# Altium schematic sheet V10_030F4_20200425.SchDoc
size A4
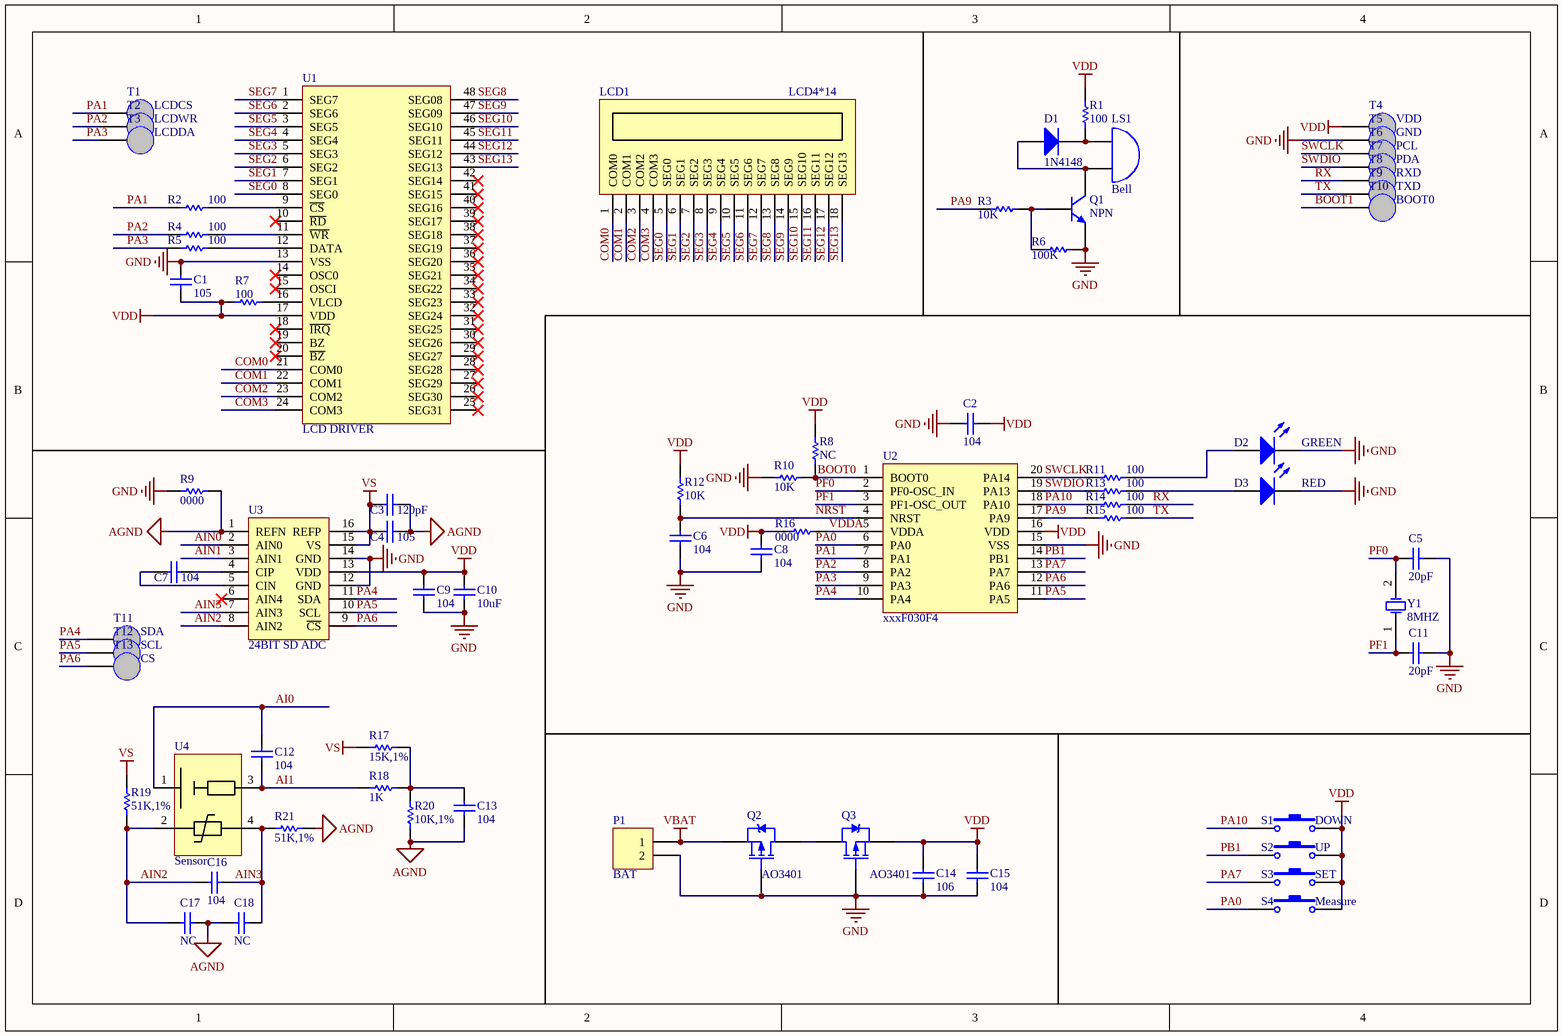
[diagram p0: V10_030F4_20200425.SchDoc]

## Parts
C1  105  [RAD-0.3]
C2  104  [RAD-0.3]
C3  120pF  [RAD-0.3]
C4  105  [RAD-0.3]
C5  20pF  [RAD-0.3]
C6  104  [RAD-0.3]
C7  104  [RAD-0.3]
C8  104  [RAD-0.3]
C9  104  [RAD-0.3]
C10  10uF  [RAD-0.3]
C11  20pF  [RAD-0.3]
C12  104  [RAD-0.3]
C13  104  [RAD-0.3]
C14  106  [RAD-0.3]
C15  104  [RAD-0.3]
C16  104  [RAD-0.3]
C17  NC  [RAD-0.3]
C18  NC  [RAD-0.3]
D1  1N4148  [SMC]
D2  GREEN  [LED-0]
D3  RED  [LED-0]
LCD1  LCD4*14
LS1  Bell  [PIN2]
P1  BAT  [HDR1X2]
Q1  NPN  [TO-226-AA]
Q2  AO3401  [TO-220AB]
Q3  AO3401  [TO-220AB]
R1  100  [AXIAL-0.3]
R2  100  [AXIAL-0.3]
R3  10K  [AXIAL-0.3]
R4  100  [AXIAL-0.3]
R5  100  [AXIAL-0.3]
R6  100K  [AXIAL-0.3]
R7  100  [AXIAL-0.3]
R8  NC  [AXIAL-0.3]
R9  0000  [AXIAL-0.3]
R10  10K  [AXIAL-0.3]
R11  100  [AXIAL-0.3]
R12  10K  [AXIAL-0.3]
R13  100  [AXIAL-0.3]
R14  100  [AXIAL-0.3]
R15  100  [AXIAL-0.3]
R16  0000  [AXIAL-0.3]
R17  15K,1%  [AXIAL-0.3]
R18  1K  [AXIAL-0.3]
R19  51K,1%  [AXIAL-0.3]
R20  10K,1%  [AXIAL-0.3]
R21  51K,1%  [AXIAL-0.3]
S1  DOWN  [SPST-2]
S2  UP  [SPST-2]
S3  SET  [SPST-2]
S4  Measure  [SPST-2]
T1  LCDCS
T2  LCDWR
T3  LCDDA
T4  VDD
T5  GND
T6  PCL
T7  PDA
T8  RXD
T9  TXD
T10  BOOT0
T11  SDA
T12  SCL
T13  CS
U1  LCD DRIVER
U2  xxxF030F4
U3  24BIT SD ADC
U4  Sensor
Y1  8MHZ  [R38]

## Nets
AGND: C3.1 C4.1 C13.1 C17.1 C18.2 R9.1 R20.1 R21.2 U3.1(REFN)
GND: C1.2 C2.2 C5.1 C6.1 C8.1 C9.2 C10.2 C11.1 C14.1 C15.1 D2.2(K) D3.2(K) P1.2 Q1.3(E) Q2.1(G) Q3.1(G) R6.2 R9.2 R10.2 T5.1(TEST) U1.13(VSS) U2.15(VSS) U3.12(GND) U3.14(GND)
VBAT: P1.1 Q2.3(S)
VDD: C1.1 C2.1 C8.2 C9.1 C10.1 C14.2 C15.2 Q3.3(S) R1.2 R7.1 R8.1 R12.1 R16.2 S1.2 S2.2 S3.2 S4.2 T4.1(TEST) U1.17(VDD) U2.16(VDD) U3.13(VDD)
VS: C3.2 C4.2 R17.2 R19.2 U3.15(VS) U3.16(REFP)
AI0: C12.2 U4.1
AI1: C12.1 R18.2 U4.3(-1)
AIN0: U3.2(AIN0)
AIN1: U3.3(AIN1)
AIN2: C16.1 C17.2 R19.1 U3.8(AIN2) U4.2
AIN3: C16.2 C18.1 R21.1 U3.7(AIN3) U4.4(-0)
BOOT0: R8.2 R10.1 U2.1(BOOT0)
BOOT1: T10.1(TEST)
COM0: LCD1.1(COM0) U1.21(COM0)
COM1: LCD1.2(COM1) U1.22(COM1)
COM2: LCD1.3(COM2) U1.23(COM2)
COM3: LCD1.4(COM3) U1.24(COM3)
NRST: C6.2 R12.2 U2.4(NRST)
PA0: S4.1 U2.6(PA0)
PA1: R2.1 T1.1(TEST) U2.7(PA1)
PA2: R4.1 T2.1(TEST) U2.8(PA2)
PA3: R5.1 T3.1(TEST) U2.9(PA3)
PA4: T11.1(TEST) U2.10(PA4) U3.11(SDA)
PA5: T12.1(TEST) U2.11(PA5) U3.10(SCL)
PA6: T13.1(TEST) U2.12(PA6) U3.9(~{CS})
PA7: S3.1 U2.13(PA7)
PA9: R3.1 R15.1 U2.17(PA9)
PA10: R14.1 S1.1 U2.18(PA10)
PB1: S2.1 U2.14(PB1)
PF0: C5.2 U2.2(PF0-OSC_IN) Y1.2(OSC2)
PF1: C11.2 U2.3(PF1-OSC_OUT) Y1.1(OSC1)
RX: R14.2 T8.1(TEST)
SEG0: LCD1.5(SEG0) U1.8(SEG0)
SEG1: LCD1.6(SEG1) U1.7(SEG1)
SEG2: LCD1.7(SEG2) U1.6(SEG2)
SEG3: LCD1.8(SEG3) U1.5(SEG3)
SEG4: LCD1.9(SEG4) U1.4(SEG4)
SEG5: LCD1.10(SEG5) U1.3(SEG5)
SEG6: LCD1.11(SEG6) U1.2(SEG6)
SEG7: LCD1.12(SEG7) U1.1(SEG7)
SEG8: LCD1.13(SEG8) U1.48(SEG08)
SEG9: LCD1.14(SEG9) U1.47(SEG09)
SEG10: LCD1.15(SEG10) U1.46(SEG10)
SEG11: LCD1.16(SEG11) U1.45(SEG11)
SEG12: LCD1.17(SEG12) U1.44(SEG12)
SEG13: LCD1.18(SEG13) U1.43(SEG13)
SWCLK: R11.1 T6.1(TEST) U2.20(PA14)
SWDIO: R13.1 T7.1(TEST) U2.19(PA13)
TX: R15.2 T9.1(TEST)
VDDA: R16.1 U2.5(VDDA)
NetC7_1: C7.1 U3.4(CIP)
NetC7_2: C7.2 U3.5(CIN)
NetC13_2: C13.2 R17.1 R18.1 R20.2
NetD1_1: D1.1(A) LS1.2(B) Q1.1(C)
NetD1_2: D1.2(K) LS1.1(A) R1.1
NetD2_1: D2.1(A) R11.2
NetD3_1: D3.1(A) R13.2
NetQ1_2: Q1.2(B) R3.2 R6.1
NetQ2_2: Q2.2(D) Q3.2(D)
NetR2_2: R2.2 U1.9(~{CS})
NetR4_2: R4.2 U1.11(~{WR})
NetR5_2: R5.2 U1.12(DATA)
NetR7_2: R7.2 U1.16(VLCD)

Not connected (* = marked no-connect by the designer): U1 10(~{RD})* 14(OSC0)* 15(OSCI)* 18(~{IRQ})* 19(BZ)* 20(~{BZ})* 25(SEG31)* 26(SEG30)* 27(SEG29)* 28(SEG28)* 29(SEG27)* 30(SEG26)* 31(SEG25)* 32(SEG24)* 33(SEG23)* 34(SEG22)* 35(SEG21)* 36(SEG20)* 37(SEG19)* 38(SEG18)* 39(SEG17)* 40(SEG16)* 41(SEG15)* 42(SEG14)*; U3 6(AIN4)*

## Library data of the parts
C1-C18 = Cap: Capacitor; Value: 100pF; Published: 8-Jun-2000; LatestRevisionDate: 17-Jul-2002; LatestRevisionNote: Re-released for DXP Platform.; PackageReference: RAD-0.3; Publisher: Altium Limited; PackageDescription: Radial Cap, Thru-Hole; 2 Leads; 0.3 in Pin Spacing
D1 = Diode: Default Diode; Published: 8-Jun-2000; LatestRevisionDate: 17-Jul-2002; LatestRevisionNote: Re-released for DXP Platform.; PackageVersion: Sep-1996; PackageReference: SMC; Publisher: Altium Limited; PackageDescription: DO-214-AB/SMC; 2 C-Bend Leads; Body 7.9 x 5.9 mm, inc. leads (LxW); Code_JEDEC: DO-214-AB
D2 D3 = LED0: Typical INFRARED GaAs LED; Published: 8-Jun-2000; LatestRevisionDate: 08-Jul-2005; LatestRevisionNote: Mech Layer 1 removed.; PackageReference: LED-0; Publisher: Altium Limited; PackageDescription: LED; 2 Leads
LCD1 = LCD-4*14: LCD Displayer
LS1 = Bell: Electrical Bell; Published: 24-Mar-1999; LatestRevisionDate: 17-Jul-2002; LatestRevisionNote: Re-released for DXP Platform.; PackageReference: PIN2; Publisher: Altium Limited
P1 = Header 2: Header, 2-Pin; LatestRevisionDate: 17-Jul-2002; LatestRevisionNote: Re-released for DXP Platform.; Publisher: Altium Limited
Q1 = NPN: NPN Bipolar Transistor; Published: 8-Jun-2000; LatestRevisionDate: 17-Jul-2002; LatestRevisionNote: Re-released for DXP Platform.; PackageReference: TO-226-AA; Publisher: Altium Limited; PackageDescription: TO, Flat Index; 3 In-Line, Axial Leads; Body Dia. 4.8mm; Leads 0.55 x 0.51 mm (max); Code_JEDEC: TO-226-AA
Q2 Q3 = PMOS-2: P-Channel Power MOSFET; Note: Pin 4 not drawn and electrically connected to Pin 2.; Published: 8-Jun-2000; LatestRevisionDate: 17-Jul-2002; LatestRevisionNote: Re-released for DXP Platform.; DatasheetVersion: PD-9.390D; PackageVersion: Feb-1997; PackageReference: TO-220AB; Publisher: Altium Limited; PackageDescription: TO, Thru-Hole, Vertical, Heatsink Mounted; 3 In-Line Leads; Pitch 2.54 mm; ComponentLink1Description: Manufacturer Link; ComponentLink1URL: http://www.irf.com/
R1-R17 R19-R21 = Res1: Resistor; Value: 1K; Published: 8-Jun-2000; LatestRevisionDate: 17-Jul-2002; LatestRevisionNote: Re-released for DXP Platform.; PackageReference: AXIAL-0.3; Publisher: Altium Limited; PackageDescription: Axial Device, Thru-Hole; 2 Leads; 0.3 in Pin Spacing
R18 = Res1: Resistor; Published: 8-Jun-2000; LatestRevisionDate: 17-Jul-2002; LatestRevisionNote: Re-released for DXP Platform.; PackageReference: AXIAL-0.3; Publisher: Altium Limited; PackageDescription: Axial Device, Thru-Hole; 2 Leads; 0.3 in Pin Spacing; Value: 1K
S1-S4 = SW-PB: Switch; Published: 24-Mar-1999; LatestRevisionDate: 17-Jul-2002; LatestRevisionNote: Re-released for DXP Platform.; PackageReference: SPST-2; Publisher: Altium Limited; PackageDescription: Switch; 2 Leads
T1-T13 = TestPad
U1 = SC1621: 32X4 LCD Driver
U2 = STM32F030F4: 32 BIT CM0
U3 = CS1259B: chipsea SD ADC
U4 = Sensor: ntc ,TP
Y1 = XTAL: Crystal Oscillator; Published: 8-Jun-2000; LatestRevisionDate: 17-Jul-2002; LatestRevisionNote: Re-released for DXP Platform.; PackageReference: R38; Publisher: Altium Limited; PackageDescription: Crystal, Thru-Hole; 2 Leads; Body 3.1 x 8.2 mm (Dia.xH)